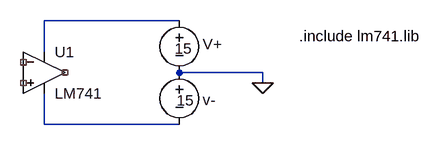
[diagram p0: schematic lm741.asc]
lm741.asc, the LTspice schematic file:
Version 4
SHEET 1 1088 680
WIRE 416 64 208 64
WIRE 208 112 208 64
WIRE 544 144 416 144
WIRE 544 160 544 144
WIRE 208 224 208 176
WIRE 416 224 208 224
FLAG 544 160 0
SYMBOL OpAmps\\opamp2 208 80 R0
SYMATTR InstName U1
SYMATTR Value LM741
SYMBOL voltage 416 48 R0
WINDOW 0 36 52 Left 2
WINDOW 3 -7 59 Left 2
WINDOW 123 0 0 Left 0
WINDOW 39 0 0 Left 0
SYMATTR InstName V+
SYMATTR Value 15
SYMBOL voltage 416 128 R0
WINDOW 0 36 58 Left 2
WINDOW 3 -4 59 Left 2
WINDOW 123 0 0 Left 0
WINDOW 39 0 0 Left 0
SYMATTR InstName v-
SYMATTR Value 15
TEXT 600 88 Left 2 !.include lm741.lib

The netlist it stands for:
* lm741.asc
XU1 NC_01 NC_02 N001 N002 NC_03 LM741  ; pins In+ In- V+ V- OUT
V+ N001 0 15
v- 0 N002 15
.include lm741.lib
.backanno
.end